# EAGLE design control_board_MCU (EAGLE 6.3)
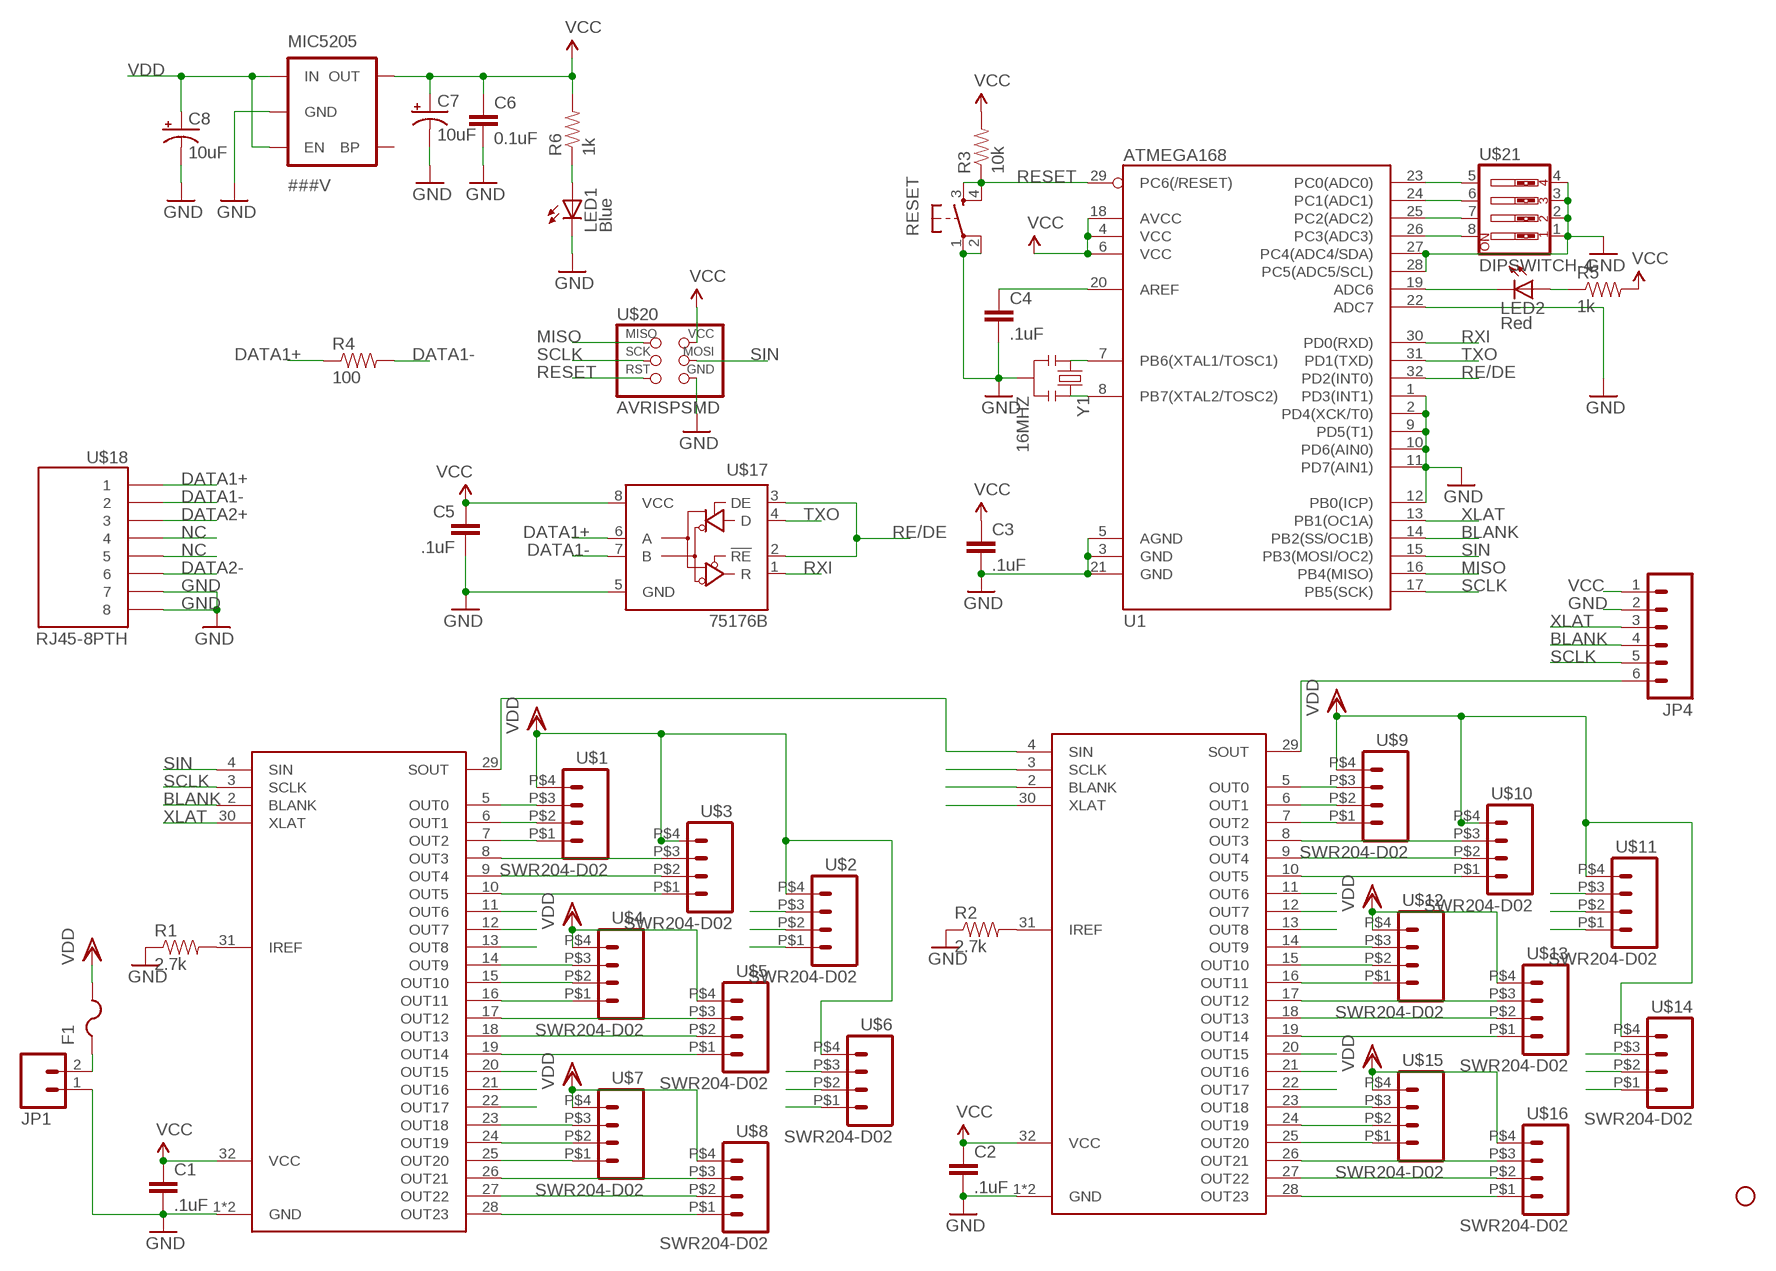
[diagram p0: schematic, sheet 1]

## Parts
C1  .1uF  CAP0402-CAP  [0402-CAP]
C2  .1uF  CAP0402-CAP  [0402-CAP]
C3  .1uF  CAP0402-CAP  [0402-CAP]
C4  .1uF  CAP0402-CAP  [0402-CAP]
C5  .1uF  CAP0402-CAP  [0402-CAP]
C6  0.1uF  CAP0402-CAP  [0402-CAP]
C7  10uF  CAP_POL1206  [EIA3216]
C8  10uF  CAP_POL1206  [EIA3216]
F1  PTCFUSE-1812  [1812]
JP1  M02-JST-2MM-SMT  [JST-2-SMD]
JP4  M06LOCK  [1X06_LOCK]
LED1  Blue  LED0603  [LED-0603]
LED2  Red  LED0603  [LED-0603]
MIC5205  ###V  V_REG_LDOSMD  [SOT23-5]
R1  2.7k  RESISTOR0603-RES  [0603-RES]
R2  2.7k  RESISTOR0603-RES  [0603-RES]
R3  10k  RESISTOR0402-RES  [0402-RES]
R4  100  RESISTOR1206  [1206]
R5  1k  RESISTOR0402  [C0402]
R6  1k  RESISTOR0402  [C0402]
RESET  TAC_SWITCHSMD  [TACTILE_SWITCH_SMD]
STANDOFF1  STAND-OFF  [STAND-OFF]
TLC5947  TLC5947DAP  [DAP]
TLC5947-2  TLC5947DAP  [DAP]
U1  ATMEGA168  [TQFP32-08]
U$1  SWR204-D02  [SWR204]
U$2  SWR204-D02  [SWR204]
U$3  SWR204-D02  [SWR204]
U$4  SWR204-D02  [SWR204]
U$5  SWR204-D02  [SWR204]
U$6  SWR204-D02  [SWR204]
U$7  SWR204-D02  [SWR204]
U$8  SWR204-D02  [SWR204]
U$9  SWR204-D02  [SWR204]
U$10  SWR204-D02  [SWR204]
U$11  SWR204-D02  [SWR204]
U$12  SWR204-D02  [SWR204]
U$13  SWR204-D02  [SWR204]
U$14  SWR204-D02  [SWR204]
U$15  SWR204-D02  [SWR204]
U$16  SWR204-D02  [SWR204]
U$17  75176B  [D_R-PDSO-G8]
U$18  RJ45-8PTH  [RJ45-8]
U$20  AVRISPSMD  [2X03SMD]
U$21  DIPSWITCH-4  [DIPSWITCH-04]
Y1  16MHZ  RESONATOR8MHZ  [RESONATOR-SMD]

## Nets
BLANK: JP4.4 TLC5947-2.2(BLANK) TLC5947.2(BLANK) U1.14(PB2(SS/OC1B))
DATA1+: R4.1 U$17.6(A) U$18.1
DATA1-: R4.2 U$17.7(B) U$18.2
DATA2+: U$18.3
DATA2-: U$18.6
GND: C1.2 C2.2 C3.2 C4.2 C5.2 C6.2 C7.C(-) C8.C(-) JP1.1 JP4.2 LED1.C MIC5205.2(GND) R1.1 R2.1 RESET.1 RESET.2 TLC5947-2.1(GND) TLC5947-2.GND TLC5947.1(GND) TLC5947.GND U1.1(PD3(INT1)) U1.2(PD4(XCK/T0)) U1.3(GND) U1.5(AGND) U1.9(PD5(T1)) U1.10(PD6(AIN0)) U1.11(PD7(AIN1)) U1.12(PB0(ICP)) U1.21(GND) U1.22(ADC7) U1.27(PC4(ADC4/SDA)) U1.28(PC5(ADC5/SCL)) U$17.5(GND) U$18.7 U$18.8 U$20.6(GND) U$21.1 U$21.2 U$21.3 U$21.4 Y1.2
MISO: U1.16(PB4(MISO)) U$20.1(MISO)
N$1: R1.2 TLC5947.31(IREF)
N$2: R2.2 TLC5947-2.31(IREF)
N$3: C4.1 U1.20(AREF)
N$4: U1.7(PB6(XTAL1/TOSC1)) Y1.1
N$5: U1.8(PB7(XTAL2/TOSC2)) Y1.3
N$6: LED2.C U1.19(ADC6)
N$7: LED2.A R5.1
N$8: F1.1 JP1.2
N$10: U1.23(PC0(ADC0)) U$21.5
N$11: U1.24(PC1(ADC1)) U$21.6
N$12: U1.25(PC2(ADC2)) U$21.7
N$13: U1.26(PC3(ADC3)) U$21.8
N$38: LED1.A R6.1
NC: U$18.4 U$18.5
OUT0: TLC5947.5(OUT0) U$1.P$3
OUT1: TLC5947.6(OUT1) U$1.P$2
OUT2: TLC5947.7(OUT2) U$1.P$1
OUT3: TLC5947.8(OUT3) U$3.P$3
OUT4: TLC5947.9(OUT4) U$3.P$2
OUT5: TLC5947.10(OUT5) U$3.P$1
OUT6: TLC5947.11(OUT6) U$2.P$3
OUT7: TLC5947.12(OUT7) U$2.P$2
OUT8: TLC5947.13(OUT8) U$2.P$1
OUT9: TLC5947.14(OUT9) U$4.P$3
OUT10: TLC5947.15(OUT10) U$4.P$2
OUT11: TLC5947.16(OUT11) U$4.P$1
OUT12: TLC5947.17(OUT12) U$5.P$3
OUT13: TLC5947.18(OUT13) U$5.P$2
OUT14: TLC5947.19(OUT14) U$5.P$1
OUT15: TLC5947.20(OUT15) U$6.P$3
OUT16: TLC5947.21(OUT16) U$6.P$2
OUT17: TLC5947.22(OUT17) U$6.P$1
OUT18: TLC5947.23(OUT18) U$7.P$3
OUT19: TLC5947.24(OUT19) U$7.P$2
OUT20: TLC5947.25(OUT20) U$7.P$1
OUT21: TLC5947.26(OUT21) U$8.P$3
OUT22: TLC5947.27(OUT22) U$8.P$2
OUT23: TLC5947.28(OUT23) U$8.P$1
OUT24: TLC5947-2.5(OUT0) U$9.P$3
OUT25: TLC5947-2.6(OUT1) U$9.P$2
OUT26: TLC5947-2.7(OUT2) U$9.P$1
OUT27: TLC5947-2.8(OUT3) U$10.P$3
OUT28: TLC5947-2.9(OUT4) U$10.P$2
OUT29: TLC5947-2.10(OUT5) U$10.P$1
OUT30: TLC5947-2.11(OUT6) U$11.P$3
OUT31: TLC5947-2.12(OUT7) U$11.P$2
OUT32: TLC5947-2.13(OUT8) U$11.P$1
OUT33: TLC5947-2.14(OUT9) U$12.P$3
OUT34: TLC5947-2.15(OUT10) U$12.P$2
OUT35: TLC5947-2.16(OUT11) U$12.P$1
OUT36: TLC5947-2.17(OUT12) U$13.P$3
OUT37: TLC5947-2.18(OUT13) U$13.P$2
OUT38: TLC5947-2.19(OUT14) U$13.P$1
OUT39: TLC5947-2.20(OUT15) U$14.P$3
OUT40: TLC5947-2.21(OUT16) U$14.P$2
OUT41: TLC5947-2.22(OUT17) U$14.P$1
OUT42: TLC5947-2.23(OUT18) U$15.P$3
OUT43: TLC5947-2.24(OUT19) U$15.P$2
OUT44: TLC5947-2.25(OUT20) U$15.P$1
OUT45: TLC5947-2.26(OUT21) U$16.P$3
OUT46: TLC5947-2.27(OUT22) U$16.P$2
OUT47: TLC5947-2.28(OUT23) U$16.P$1
RE/DE: U1.32(PD2(INT0)) U$17.2(!RE) U$17.3(DE)
RESET: R3.1 RESET.3 RESET.4 U1.29(PC6(/RESET)) U$20.5(RST)
RXI: U1.30(PD0(RXD)) U$17.1(R)
SCLK: JP4.5 TLC5947-2.3(SCLK) TLC5947.3(SCLK) U1.17(PB5(SCK)) U$20.3(SCK)
SIN: TLC5947.4(SIN) U1.15(PB3(MOSI/OC2)) U$20.4(MOSI)
SOUT: TLC5947-2.4(SIN) TLC5947.29(SOUT)
SOUT1: JP4.6 TLC5947-2.29(SOUT)
TXO: U1.31(PD1(TXD)) U$17.4(D)
VCC: C1.1 C2.1 C3.1 C5.1 C6.1 C7.A(+) JP4.1 MIC5205.5(OUT) R3.2 R5.2 R6.2 TLC5947-2.32(VCC) TLC5947.32(VCC) U1.4(VCC) U1.6(VCC) U1.18(AVCC) U$17.8(VCC) U$20.2(VCC)
VDD: C8.A(+) F1.2 MIC5205.1(IN) MIC5205.3(EN) U$1.P$4 U$2.P$4 U$3.P$4 U$4.P$4 U$5.P$4 U$6.P$4 U$7.P$4 U$8.P$4 U$9.P$4 U$10.P$4 U$11.P$4 U$12.P$4 U$13.P$4 U$14.P$4 U$15.P$4 U$16.P$4
XLAT: JP4.3 TLC5947-2.30(XLAT) TLC5947.30(XLAT) U1.13(PB1(OC1A))
Unconnected: MIC5205.4(BP)

## Library data of the parts
C1-C6 = SparkFun-Capacitors:CAP: Capacitor Standard 0603 ceramic capacitor, and 0.1" leaded capacitor.
C7 C8 = SparkFun:CAP_POL: Capacitor Polarized These are standard SMD and PTH capacitors. Normally 10uF, 47uF, and 100uF in electrolytic and tantalum varieties. Always verify the external diameter of the through hole cap, it varies with capacity, voltage, and manufacturer. The EIA devices should be standard.
F1 = adafruit:PTCFUSE: PTC fuses, resettable thermistors
JP1 = SparkFun-Connectors:M02: Header 2 Standard 2-pin 0.1" header. Use with straight break away headers (SKU : PRT-00116), right angle break away headers (PRT-00553), swiss pins (PRT-00743), machine pins (PRT-00117), and female headers (PRT-00115). Molex polarized connector foot print use with SKU : PRT-08233 with associated crimp pins and housings.; PROD_ID: CONN-08352
JP4 = SparkFun-Connectors:M06: Header 6 Standard 6-pin 0.1" header. Use with straight break away headers (SKU : PRT-00116), right angle break away headers (PRT-00553), swiss pins (PRT-00743), machine pins (PRT-00117), and female headers (PRT-00115). Molex polarized connector foot print use with SKU : PRT-08094 with associated crimp pins and housings. NOTES ON THE VARIANTS LOCK and LOCK_LONGPADS... This footprint was designed to help hold the alignment of a through-hole component (i.e. 6-pin header) while soldering it into place. You may notice that each hole has been shifted either up or down by 0.005 of an inch from it's more standard position (which is a perfectly straight line). This slight alteration caused the pins (the squares in the middle) to touch the edges of the holes. Because they are alternating, it causes a "brace" to hold the component in place. 0.005 has proven to be the perfect amount of "off-center" position when using our standard breakaway headers. Although looks a little odd when you look at the bare footprint, once you have a header in there, the alteration is very hard to notice. Also, if you push a header all the way into place, it is covered up entirely on the bottom side. This idea of altering the position of holes to aid alignment will be further integrated into the Sparkfun Library for other footprints. It can help hold any component with 3 or more connection pins.
LED1 LED2 = SparkFun:LED: LEDs Standard schematic elements and footprints for 5mm, 3mm, 1206, and 0603 sized LEDs. 5mm - Spark Fun Electronics SKU : COM-00529 (and others)
MIC5205 = SparkFun:V_REG_LDO: Voltage Regulator LDO Standard 150mA LDO voltage regulator in SOT-23 layout. Micrel part MIC5205. BP (by-pass) pin is used to lower output noise with 470pF cap.
R1 R2 = SparkFun-Resistors:RESISTOR: Resistor
R3 R4 = SparkFun-Passives:RESISTOR: Resistor
R5 R6 = SparkFun:RESISTOR: Resistor
RESET = SparkFun-Electromechanical:TAC_SWITCH: Momentary Switch Button commonly used for reset or general input. Spark Fun Electronics SKU : COM-00097 SMT- SWCH-08247; PROD_ID: SWCH-08247
STANDOFF1 = SparkFun-Electromechanical:STAND-OFF: #4 Stand Off This is the mechanical footprint for a #4 phillips button head screw. Use the keepout ring to avoid running the screw head into surrounding components. SKU : PRT-00447
TLC5947 TLC5947-2 = SparkFun-DigitalIC:TLC5947
U1 = SparkFun-DigitalIC:ATMEGA168: Atmel 32-pin 8-bit micro, 16k flash.
U$1-U$16 = SparkFun-Connectors:SWR204-D02
U$17 = 751xx:75176B: 75176B
U$18 = SparkFun-Connectors:RJ45-8: RJ45 Jack Simple RJ45, 8-pin connection - connector for common Cat5, Cat5e, and Cat6 Ethernet cables. Footprint not yet proven in production. Connector sku is PRT-00643; Breakout PCB sku is BOB-00716.
U$20 = fab:AVRISP
U$21 = SparkFun-Electromechanical:DIPSWITCH-4
Y1 = SparkFun-FreqCtrl:RESONATOR: Resonator Small SMD resonator. Used, eg, on the Arduino Pro/ Pro Mini boards. 8MHz- XTAL-08895 16MHz- XTAL-08900; PROD_ID: XTAL-08895; VALUE: 8MHZ

## Net classes
1 vcc: width 0.254 mm

## Board
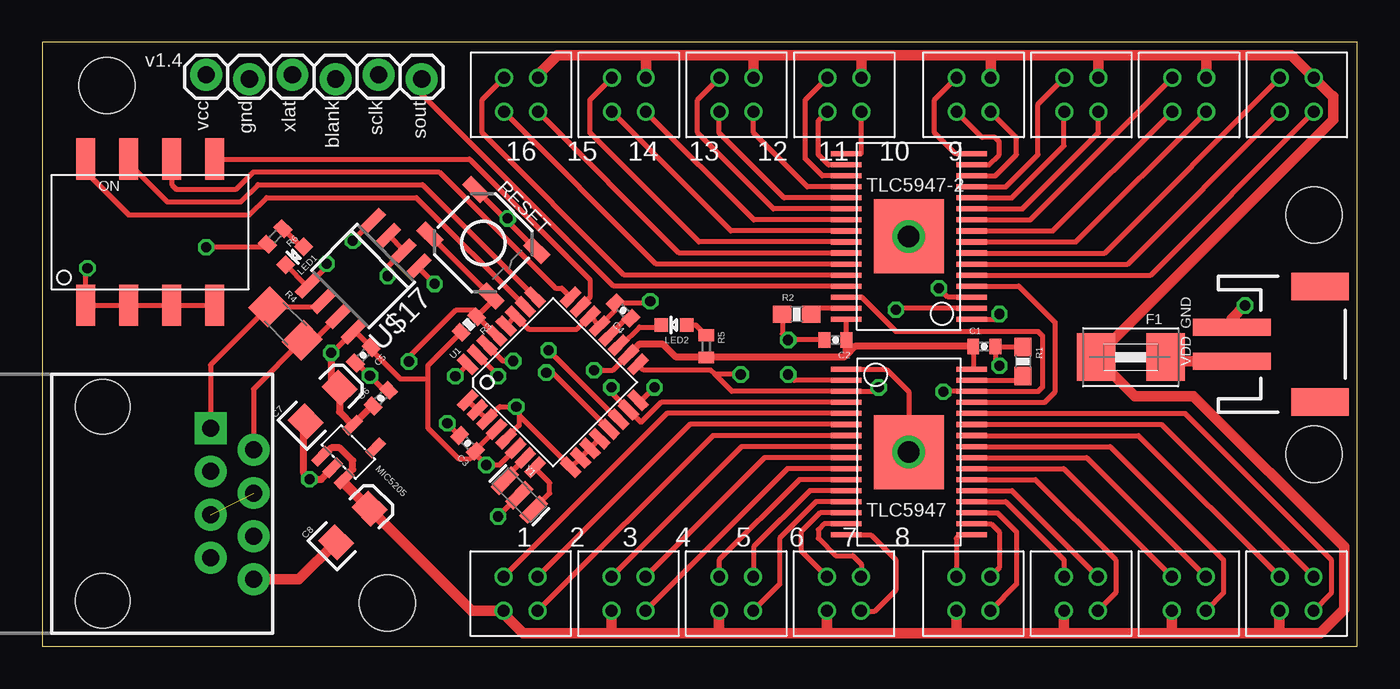
[diagram p1: board, top side]
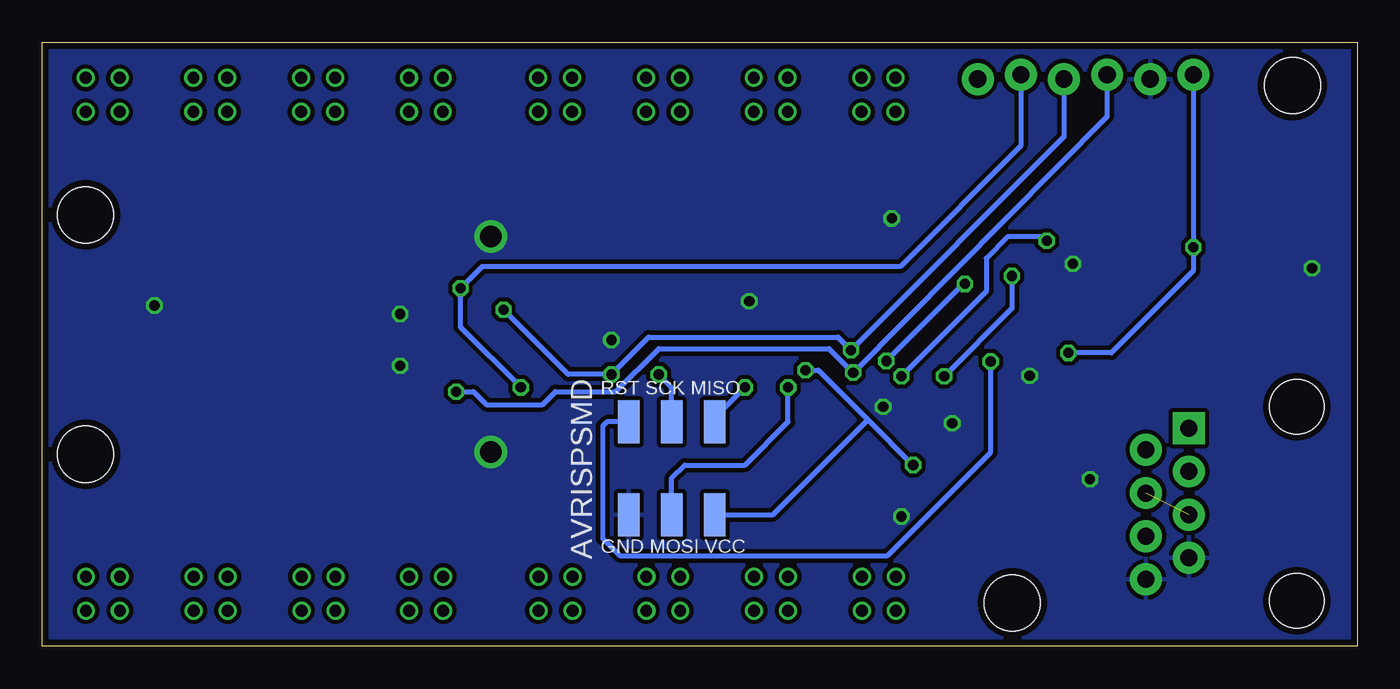
[diagram p2: board, bottom side, seen from below]

Size 77.47 x 35.56 mm. Coordinates in mm from the lower left corner, seen from the top.
Outline: 0,0 77.47,0 77.47,35.56 0,35.56 0,0
Copper layers (1*16): Top 0.0356mm / dielectric 1.5011mm / Bottom 0.0356mm
Design rules "LaenPCBOrder *": minimum track width 6mil, minimum drill 13mil, track to track 10mil, track to pad 6mil, pad to pad 6mil, via to via 6mil, smd to smd 6mil, copper to edge 15mil, drill to drill 6mil, minimum pad ring 7mil, minimum via ring 7mil, stop-mask expansion 4mil, vias tented up to drill 0mil, thermal gap 10mil

### Footprints (pad centres in the part's own frame; a part is rotated, then mirrored left to right if it is on the bottom)
0402-CAP = smd 0.7 x 0.9: 1 -0.65,0; 2 0.65,0
EIA3216 = smd 1.4 x 1.6: A 1.4,0; C -1.4,0
1812 = smd 2.286 x 2.794: 1 -2.046,0; 2 2.046,0
JST-2-SMD = smd 1 x 4.6: 1 -1,-3.7; 2 1,-3.7 | smd 1.6 x 3.4: NC1 -3.4,1.5; NC2 3.4,1.5
1X06_LOCK = drill 1.016 pad 1.88: 1 0,0; 2 2.54,-0.254; 3 5.08,0; 4 7.62,-0.254; 5 10.16,0; 6 12.7,-0.254
LED-0603 = smd 0.8 x 0.8: A 0,-0.75; C 0,0.75
SOT23-5 = smd 0.55 x 1.2: 1 -0.95,-1.3; 2 0,-1.3; 3 0.95,-1.3; 4 0.95,1.3; 5 -0.95,1.3
0603-RES = smd 1.1 x 1: 1 -0.85,0; 2 0.85,0
0402-RES = smd 0.7 x 0.9: 1 -0.65,0; 2 0.65,0
1206 = smd 1.6 x 1.8: 1 -1.4,0; 2 1.4,0
C0402 = smd 0.7 x 0.9: 1 -0.65,0; 2 0.65,0
TACTILE_SWITCH_SMD = smd 1.524 x 0.762: 1 -2.54,1.905; 2 2.54,1.905; 3 -2.54,-1.905; 4 2.54,-1.905
STAND-OFF = hole 3.302: 0,0
DAP = smd 0.3 x 1.8: 1 -4.875,-3.7; 2 -4.225,-3.7; 3 -3.575,-3.7; 4 -2.925,-3.7; 5 -2.275,-3.7; 6 -1.625,-3.7; 7 -0.975,-3.7; 8 -0.325,-3.7; 9 0.325,-3.7; 10 0.975,-3.7; 11 1.625,-3.7; 12 2.275,-3.7; 13 2.925,-3.7; 14 3.575,-3.7; 15 4.225,-3.7; 16 4.875,-3.7; 17 4.875,3.7; 18 4.225,3.7; 19 3.575,3.7; 20 2.925,3.7; 21 2.275,3.7; 22 1.625,3.7; 23 0.975,3.7; 24 0.325,3.7; 25 -0.325,3.7; 26 -0.975,3.7; 27 -1.625,3.7; 28 -2.275,3.7; 29 -2.925,3.7; 30 -3.575,3.7; 31 -4.225,3.7; 32 -4.875,3.7 | smd 4.36 x 4.11: GND 0,0
TQFP32-08 = smd 1.27 x 0.559: 1 -4.293,2.8; 2 -4.293,2; 3 -4.293,1.2; 4 -4.293,0.4; 5 -4.293,-0.4; 6 -4.293,-1.2; 7 -4.293,-2; 8 -4.293,-2.8; 17 4.293,-2.8; 18 4.293,-2; 19 4.293,-1.2; 20 4.293,-0.4; 21 4.293,0.4; 22 4.293,1.2; 23 4.293,2; 24 4.293,2.8 | smd 0.559 x 1.27: 9 -2.8,-4.293; 10 -2,-4.293; 11 -1.2,-4.293; 12 -0.4,-4.293; 13 0.4,-4.293; 14 1.2,-4.293; 15 2,-4.293; 16 2.8,-4.293; 25 2.8,4.293; 26 2,4.293; 27 1.2,4.293; 28 0.4,4.293; 29 -0.4,4.293; 30 -1.2,4.293; 31 -2,4.293; 32 -2.8,4.293
SWR204 = drill 0.7: P$1 -0.99,0.96; P$2 -0.99,-1.04; P$3 1.01,-1.04; P$4 1.01,0.96
D_R-PDSO-G8 = smd 0.6 x 1.5: 1 -1.905,-2.75; 2 -0.635,-2.75; 3 0.635,-2.75; 4 1.905,-2.75; 5 1.905,2.75; 6 0.635,2.75; 7 -0.635,2.75; 8 -1.905,2.75
RJ45-8 = drill 1 pad 1.88 square: 1 -4.445,6.35 | drill 1 pad 1.88: 2 -3.175,8.89; 3 -1.905,6.35; 4 -0.635,8.89; 5 0.635,6.35; 6 1.905,8.89; 7 3.175,6.35; 8 4.445,8.89 | hole 3.2: -5.715,0; 5.715,0
2X03SMD = smd 2.54 x 1.27: 1 -2.54,2.54; 2 2.92,2.54; 3 -2.54,0; 4 2.92,0; 5 -2.54,-2.54; 6 2.92,-2.54
DIPSWITCH-04 = smd 1.118 x 2.438: 1 -3.81,-4.305; 2 -1.27,-4.305; 3 1.27,-4.305; 4 3.81,-4.305; 5 3.81,4.305; 6 1.27,4.305; 7 -1.27,4.305; 8 -3.81,4.305
RESONATOR-SMD = smd 0.7 x 1.7: 1 -1.2,0; 2 0,0; 3 1.2,0

### Placement (x,y rotation side)
C1  55.5,17.65 0 top
C2  46.74,18.03 180 top
C3  25.05,11.95 135 top
C4  34.21,19.77 135 top
C5  18.9,17.13 225 top
C6  19.94,14.61 45 top
C7  16.51,14.22 45 top
C8  18.29,7.11 45 top
F1  64.13,17.02 180 top
JP1  73.79,17.78 270 top
JP4  9.65,33.66 0 top
LED1  14.86,22.99 135 top
LED2  37.21,18.92 90 top
MIC5205  18.03,11.43 315 top
R1  57.78,16.76 270 top
R2  44.45,19.56 0 top
R3  25.12,18.95 225 top
R4  14.32,19 315 top
R5  39.12,17.65 270 top
R6  13.72,24.13 225 top
RESET  25.98,23.76 315 top
STANDOFF1  74.93,25.4 0 top
STANDOFF2  STAND-OFF  [STAND-OFF]  3.81,33.02 0 top
STANDOFF3  STAND-OFF  [STAND-OFF]  20.32,2.54 0 top
STANDOFF4  STAND-OFF  [STAND-OFF]  74.93,11.3 0 top
TLC5947  51.05,11.43 270 top
TLC5947-2  51.05,24.13 90 top
U1  30.08,15.54 45 top
U$1  28.19,3.05 180 top
U$2  40.89,3.05 180 top
U$3  34.54,3.05 180 top
U$4  47.24,3.05 180 top
U$5  54.86,3.05 180 top
U$6  61.21,3.05 180 top
U$7  67.56,3.05 180 top
U$8  73.91,3.05 180 top
U$9  73.91,32.51 0 top
U$10  67.56,32.51 0 top
U$11  61.21,32.51 0 top
U$12  54.86,32.51 0 top
U$13  47.24,32.51 0 top
U$14  40.89,32.51 0 top
U$15  34.54,32.51 0 top
U$16  28.19,32.51 0 top
U$17  18.9,21.8 135 top
U$18  3.56,8.38 270 top
U$20  40.39,10.67 270 bottom
U$21  6.35,24.38 0 top
Y1  28.1,8.89 315 top

### Tracks (layer width: path | path; a pad name or v marks a point on that pad's centre or on a via)
BLANK  (via drill 0.6)
  Top 0.305: TLC5947.2 44.29,15.65 v43.94,16 | U1.14 33.89,13.35 33.89,13.37 v29.83,17.43 | TLC5947-2.2 50.38,19.91 v50.29,19.81
  Bottom 0.305: v50.29,19.81 46.48,16 v43.94,16 41.75,18.2 30.59,18.2 v29.83,17.43 17.27,29.99 JP4.4
DATA1+
  Top 0.305: 16.49,20.3 U$17.6 16.19,19.99 R4.1 9.91,16.56 U$18.1
DATA1-
  Top 0.305: U$17.7 16.01,18.01 R4.2 12.45,15.14 U$18.2
GND  (via drill 0.6, 1.27)
  Top 0.305: TLC5947.1 49.73,16.3 51.05,14.99 TLC5947.GND | R2.1 43.6,18.38 v43.94,18.03 C2.2 | U1.5 28.1,13 28.1,13.59 | 28.1,13.59 28.1,13.92 v27.92,14.1 26.94,14.1 U1.3 U1.2 U1.1 | C3.2 v23.87,13.13 | Y1.2 v26.84,7.63 | RESET.2 27.33,25.11 | 27.33,25.11 RESET.1 | v27.42,25.2 27.33,25.11 | v16.75,22.52 16.75,22.34 U$17.5 14.36,22.46 LED1.C | v56.39,16.51 56.15,16.75 C1.2 56.19,17.61 R1.1 | C5.2 18.55,16.67 v19.29,15.92 20.28,14.94 C6.2 | v35.81,20.32 35.73,20.23 C4.2 33.75,19.77 U1.21 U1.22 32.25,19.42 31.5,18.67 28.64,18.67 U1.27 U1.28 | TLC5947-2.1 56.09,19.25 v56.39,19.56 | U$21.4 U$21.3 U$21.2 U$21.1 2.54,22.16 v2.65,22.27 | U1.12 U1.11 U1.10 U1.9 31.13,10.56 28.1,13.59
  Top 0.406: MIC5205.2 16.43,9.83 v15.74,9.83 15.39,10.17 15.39,13.11 C7.C
  Top 0.61: 26.72,7.51 v26.84,7.63 | C8.C 15.11,3.94 U$18.8 | JP1.1 70.09,19.29 v70.87,20.07
  other vias: 51.05,11.43 51.05,24.13
  pour Bottom: 0,0 0,35.56 77.47,35.56 77.47,0
MISO  (via drill 0.6)
  Top 0.305: U1.16 35.31,14.48 v36.07,15.24
  Bottom 0.305: U$20.1 37.59,13.72 v36.07,15.24
N$1
  Top 0.305: TLC5947.31 57.53,15.65 R1.2
N$2
  Top 0.305: TLC5947-2.31 45.65,19.91 R2.2
N$3
  Top 0.305: U1.20 34.42,19.31 C4.1
N$4
  Top 0.305: U1.7 27.25,9.88 Y1.1
N$5
  Top 0.305: Y1.3 29.9,8.99 29.9,9.61 29.02,10.49 U1.8
N$6
  Top 0.305: U1.19 34.11,17.72 35.18,18.8 36.33,18.8 LED2.C
N$7
  Top 0.305: LED2.A 38.5,18.92 R5.1
N$8
  Top 0.61: F1.1 66.42,16.78 JP1.2
N$10
  Top 0.305: U$21.5 25.16,28.69 32.26,21.59 32.26,20.55 U1.23
N$11
  Top 0.305: 7.62,28.7 U$21.6 7.62,27.18 7.87,26.92 11.43,26.92 12.45,27.94 23.37,27.94 30.23,21.08 30.6,21.08 U1.24
N$12
  Top 0.305: U$21.7 5.08,28.45 7.37,26.16 11.68,26.16 12.7,27.18 22.4,27.18 U1.25
N$13
  Top 0.305: U$21.8 2.54,27.94 5.08,25.4 12.19,25.4 13.21,26.42 22.03,26.42 U1.26
N$38
  Top 0.305: R6.1 15.25,23.52 LED1.A
NC  (1 unrouted)
OUT0
  Top 0.305: TLC5947.5 36.8,13.71 U$1.P$3
OUT1
  Top 0.305: TLC5947.6 38.15,13.05 U$1.P$2
OUT2
  Top 0.305: TLC5947.7 39.5,12.4 U$1.P$1
OUT3
  Top 0.305: TLC5947.8 41.2,11.76 U$3.P$3
OUT4
  Top 0.305: TLC5947.9 42.55,11.11 U$3.P$2
OUT5
  Top 0.305: TLC5947.10 43.9,10.46 U$3.P$1
OUT6
  Top 0.305: TLC5947.11 44.6,9.8 39.88,5.08 U$2.P$3
OUT7
  Top 0.305: TLC5947.12 45.22,9.15 41.91,5.84 41.91,4.11 U$2.P$2
OUT8
  Top 0.305: TLC5947.13 45.59,8.51 43.43,6.35 43.43,3.64 U$2.P$1
OUT9
  Top 0.305: TLC5947.14 45.83,7.86 44.7,6.73 44.7,5.62 U$4.P$3
OUT10
  Top 0.305: TLC5947.15 46.07,7.21 45.72,6.86 45.72,6.35 46.74,5.33 47.75,5.33 48.26,4.83 48.26,4.11 U$4.P$2
OUT11
  Top 0.305: TLC5947.16 48.82,6.55 50.29,5.08 50.29,3.3 49.02,2.03 48.29,2.03 U$4.P$1
OUT12
  Top 0.305: TLC5947.17 54.05,6.55 53.85,6.35 U$5.P$3
OUT13
  Top 0.305: TLC5947.18 55.91,7.21 56.39,6.73 56.39,4.62 U$5.P$2
OUT14
  Top 0.305: TLC5947.19 56.28,7.86 57.4,6.73 57.4,3.64 U$5.P$1
OUT15
  Top 0.305: TLC5947.20 56.77,8.51 60.2,5.08 U$6.P$3
OUT16
  Top 0.305: TLC5947.21 57.14,9.15 U$6.P$2
OUT17
  Top 0.305: TLC5947.22 58.52,9.8 63.25,5.08 63.25,3.13 U$6.P$1
OUT18
  Top 0.305: TLC5947.23 60.19,10.46 U$7.P$3
OUT19
  Top 0.305: TLC5947.24 61.54,11.11 U$7.P$2
OUT20
  Top 0.305: TLC5947.25 62.92,11.76 69.6,5.08 69.6,3.13 U$7.P$1
OUT21
  Top 0.305: TLC5947.26 64.59,12.4 U$8.P$3
OUT22
  Top 0.305: TLC5947.27 65.94,13.05 U$8.P$2
OUT23
  Top 0.305: TLC5947.28 67.32,13.71 75.95,5.08 75.95,3.13 U$8.P$1
OUT24
  Top 0.305: TLC5947-2.5 65.31,21.86 U$9.P$3
OUT25
  Top 0.305: TLC5947-2.6 63.96,22.5 U$9.P$2
OUT26
  Top 0.305: TLC5947-2.7 62.61,23.16 U$9.P$1
OUT27
  Top 0.305: TLC5947-2.8 60.91,23.8 U$10.P$3
OUT28
  Top 0.305: TLC5947-2.9 59.56,24.45 U$10.P$2
OUT29
  Top 0.305: TLC5947-2.10 58.21,25.11 U$10.P$1
OUT30
  Top 0.305: TLC5947-2.11 57.76,25.75 62.23,30.23 U$11.P$3
OUT31
  Top 0.305: TLC5947-2.12 57.14,26.41 60.2,29.46 60.2,31.45 U$11.P$2
OUT32
  Top 0.305: TLC5947-2.13 56.77,27.05 58.67,28.96 58.67,31.92 U$11.P$1
OUT33
  Top 0.305: TLC5947-2.14 56.15,27.7 57.4,28.96 57.4,29.94 U$12.P$3
OUT34
  Top 0.305: TLC5947-2.15 55.79,28.36 56.39,28.96 56.39,29.72 56.13,29.97 55.37,29.97 U$12.P$2
OUT35
  Top 0.305: TLC5947-2.16 53.8,29 52.58,30.23 52.58,32.18 U$12.P$1
OUT36
  Top 0.305: TLC5947-2.17 48.25,29 U$13.P$3
OUT37
  Top 0.305: TLC5947-2.18 46.32,28.36 45.72,28.96 45.72,30.94 U$13.P$2
OUT38
  Top 0.305: TLC5947-2.19 45.95,27.7 44.96,28.7 44.96,32.18 U$13.P$1
OUT39
  Top 0.305: TLC5947-2.20 45.08,27.05 41.91,30.23 U$14.P$3
OUT40
  Top 0.305: TLC5947-2.21 43.7,26.41 39.88,30.23 39.88,31.45 U$14.P$2
OUT41
  Top 0.305: TLC5947-2.22 43.08,25.75 38.61,30.23 38.61,32.18 U$14.P$1
OUT42
  Top 0.305: TLC5947-2.23 41.92,25.11 U$15.P$3
OUT43
  Top 0.305: TLC5947-2.24 40.57,24.45 U$15.P$2
OUT44
  Top 0.305: TLC5947-2.25 38.68,23.8 32.26,30.23 32.26,32.18 U$15.P$1
OUT45
  Top 0.305: TLC5947-2.26 37.52,23.16 U$16.P$3
OUT46
  Top 0.305: TLC5947-2.27 36.17,22.5 U$16.P$2
OUT47
  Top 0.305: TLC5947-2.28 34.28,21.86 25.91,30.23 25.91,32.18 U$16.P$1
RE/DE  (via drill 0.6)
  Top 0.305: U$17.3 U$17.2 20.34,22.34 v20.34,21.8 | U1.32 24.37,15.9 v24.33,15.9
  Bottom 0.305: v20.34,21.8 20.34,19.89 v24.33,15.9
RESET  (via drill 0.6)
  Top 0.305: 26.73,18.29 U1.29 25.72,19.32 R3.1 | 25.6,19.55 R3.1 | RESET.3 RESET.4 26.43,20.26 R3.1 | R3.1 25.72,19.65 | v21.59,16.76 21.59,17.02 24.38,19.81 25.46,19.81 R3.1
  Bottom 0.305: U$20.5 44.2,13.21 44.45,12.95 44.45,6.35 43.43,5.33 27.69,5.33 21.59,11.43 v21.59,16.76
RXI  (via drill 0.6)
  Top 0.305: U1.30 27.12,16.8 v27.74,16.8 | U$17.1 22.19,22.26 v23.11,21.34
  Bottom 0.305: v23.11,21.34 23.2,21.34 v27.74,16.8
SCLK  (via drill 0.6)
  Top 0.305: v49.28,15.24 49.04,15.01 TLC5947.3 40.62,15.01 39.62,16 | TLC5947-2.3 53.36,20.55 v52.83,21.08 | U1.17 35.43,16.26 39.37,16.26 39.62,16 | v41.15,16 39.62,16
  Bottom 0.305: v49.28,15.24 52.83,18.8 v52.83,21.08 51.56,22.35 26.92,22.35 19.81,29.46 JP4.5 | U$20.3 40.39,15.24 v41.15,16
SIN  (via drill 0.6)
  Top 0.305: TLC5947.4 36.45,14.36 35.31,13.21 35.23,13.21 U1.15 33.53,14.91 v33.53,15.24
  Bottom 0.305: v33.53,15.24 33.53,13.21 36.07,10.67 39.62,10.67 40.39,9.91 U$20.4
SOUT
  Top 0.305: TLC5947-2.4 57.53,21.2 59.69,19.05 59.69,14.99 59.06,14.36 TLC5947.29
SOUT1
  Top 0.305: TLC5947-2.29 33.66,21.2 22.35,32.51 JP4.6
TXO  (via drill 0.6)
  Top 0.305: U1.31 26.84,15.94 v26.84,15.9 | U$17.4 v18.29,23.88
  Bottom 0.305: v26.84,15.9 21.84,20.9 21.84,22.86 20.57,24.13 18.54,24.13 v18.29,23.88
VCC  (via drill 0.6)
  Top 0.305: 47.35,17.8 C2.1 47.35,18.07 TLC5947-2.32 | U1.4 26.73,12.79 C3.1 25.51,11.33 | 25.51,11.33 25.23,11.05 24.51,11.05 22.71,12.84 22.71,15.75 | C1.1 54.85,16.4 TLC5947.32 | 22.71,15.75 22.71,16.54 R3.2 | 25.51,11.33 25.51,11.32 v26.16,10.67 26.92,10.67 27.89,11.63 U1.6 | v32.51,16.26 33.62,16.26 U1.18 | 22.71,15.75 21.08,15.75 19.36,17.47 C5.1 18.44,18.51 U$17.8 17.07,17.27 v17.02,17.27 | 37.34,17.02 39.1,17.02 R5.2 | R6.2 13.08,23.5 v9.65,23.5
  Top 0.406: C1.1 47.88,17.65 47.37,17.14 | 47.37,17.14 47.24,17.02 37.34,17.02 36.58,17.78 35.15,17.78 U1.18 | 47.35,17.8 47.35,17.16 47.37,17.14 | C6.1 19.28,14.02 MIC5205.5 17.5,13.8 C7.A 17.02,15.7 v17.02,17.27
  Bottom 0.305: v32.51,16.26 31.75,16.26 28.83,13.34 | 28.83,13.34 v26.16,10.67 | 28.83,13.34 34.42,7.75 U$20.2 | 16.76,17.02 v17.02,17.27 14.48,17.27 9.65,22.1 v9.65,23.5 JP4.1
VDD
  Top 0.406: MIC5205.3 17.79,9.91 18.29,10.41 18.29,10.92 17.53,11.68 17.02,11.68 16.76,11.43 16.69,11.43 MIC5205.1
  Top 0.61: MIC5205.3 17.79,9.59 C8.A 25.29,2.09 U$1.P$4 27.18,1.9 28.32,0.76 33.53,0.76 | 74.99,33.47 U$9.P$4 | 68.58,34.8 73.6,34.8 U$9.P$4 | 68.58,34.8 62.23,34.8 | 62.23,34.8 55.88,34.8 | 55.88,34.8 48.26,34.8 | 48.26,34.8 41.91,34.8 | 41.91,34.8 35.56,34.8 | 35.56,34.8 30.35,34.8 29.2,33.65 U$16.P$4 | U$9.P$4 76.01,32.38 76.07,32.38 76.07,31 F1.2 64.38,14.73 67.82,14.73 76.71,5.84 76.71,2.16 75.31,0.76 72.9,0.76 | U$15.P$4 35.56,34.8 | U$14.P$4 41.91,34.8 | U$13.P$4 48.26,34.8 | U$12.P$4 55.88,34.8 | U$11.P$4 62.23,34.8 | U$10.P$4 68.58,34.8 | 72.9,0.76 66.55,0.76 | 66.55,0.76 60.2,0.76 | 60.2,0.76 53.85,0.76 | 53.85,0.76 46.23,0.76 | 46.23,0.76 39.88,0.76 | 39.88,0.76 33.53,0.76 | U$8.P$4 72.9,0.76 | U$7.P$4 66.55,0.76 | U$6.P$4 60.2,0.76 | U$5.P$4 53.85,0.76 | U$3.P$4 33.53,0.76 | U$2.P$4 39.88,0.76 | U$4.P$4 46.23,0.76
XLAT  (via drill 0.6)
  Top 0.305: v53.09,14.99 53.1,15.01 TLC5947.30 54.77,14.99 58.67,14.99 58.93,15.24 58.93,18.29 58.67,18.54 50.29,18.54 48.28,20.55 TLC5947-2.30 | v29.69,16.11 30.07,16.11 U1.13
  Bottom 0.305: v53.09,14.99 52.07,14.99 51.31,14.22 48.01,14.22 47.24,14.99 43.69,14.99 41.15,17.53 31.11,17.53 v29.7,16.11 v29.69,16.11 14.73,31.19 JP4.3

### Text on the board
tPlace: v1.4 | vcc / gnd / xlat / blank / sclk / sout | VDD GND
tNames: 16 15 14 13 12 11 10 9 | 1 2 3 4 5 6 7 8
bNames: RST SCK MISO / / / / / GND MOSI VCC